# Altium schematic sheet USB.SchDoc: USB to UART
size A; CompanyName: CUInSpace; DrawnBy: Matteo Golin; Engineer: Matteo Golin; Organization: CUInSpace; Revision: B; SheetNumber: 2; SheetTotal: 2
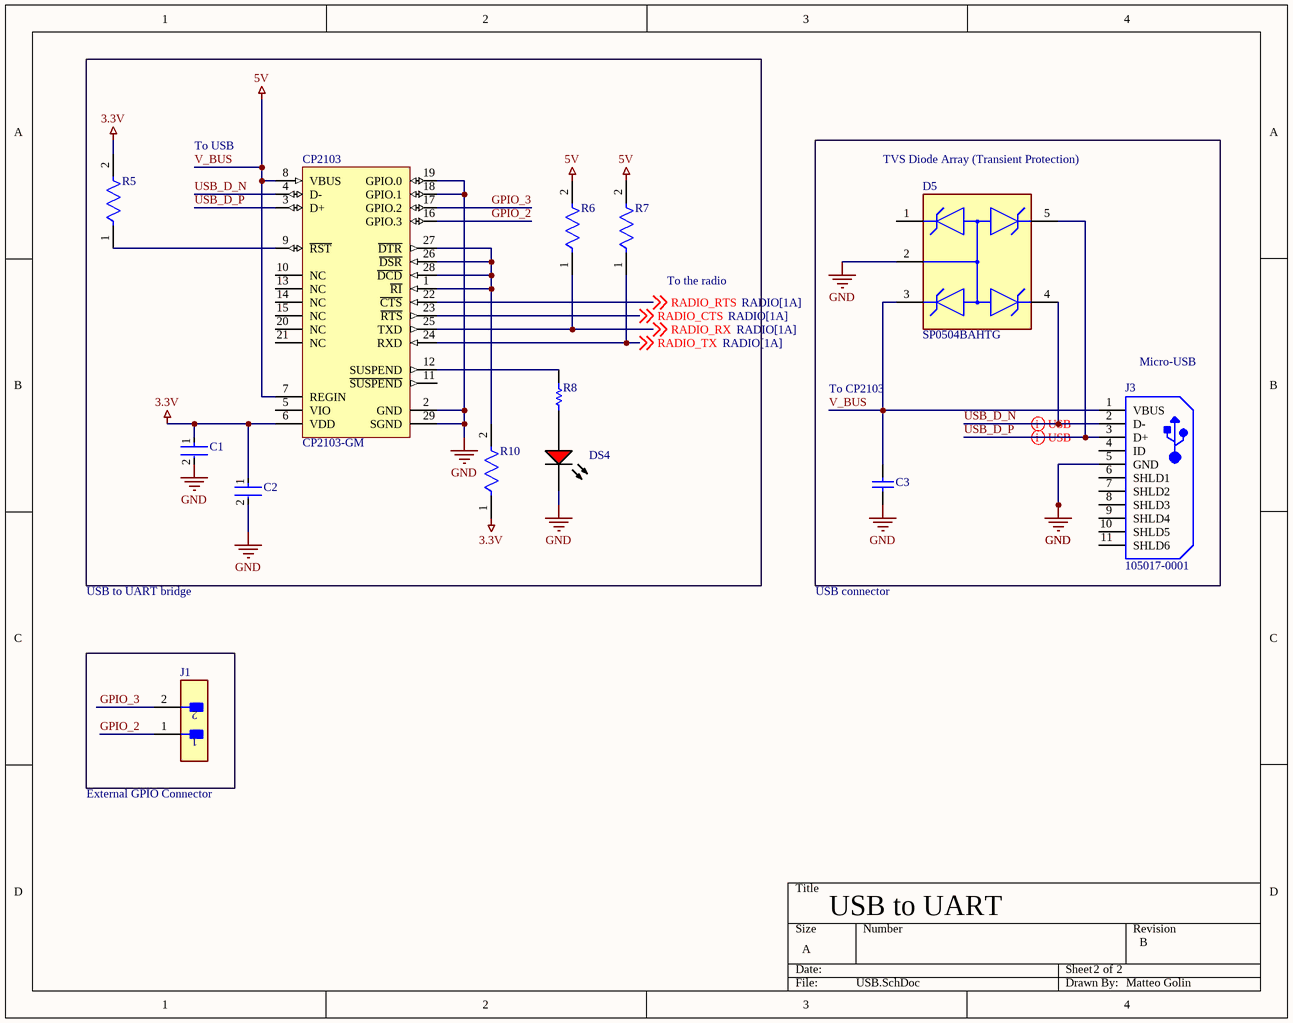
[diagram p0: USB.SchDoc]

## Parts
C1  C0603C104K5RACTU  [FP-C0603C-CF-MFG]  (value not drawn)
C2  C0603C475K9PACTU  [FP-C0603-CG-MFG]  (value not drawn)
C3  C1206C105K5RACTU  [CAPC3216X110X50LL20T25]  (value not drawn)
CP2103  CP2103-GM  [SLAB-QFN-28-3125x3125TP_A_M]
D5  SP0504BAHTG  [FP-SP0504BAHTG-MFG]
DS4  HSMH-C190  [AVAG-HSMX-C190_V]  (value not drawn)
J1  M22-2510205  [FP-M22-2510205-MFG]  (value not drawn)
J3  105017-0001  [USB-MICRO-B_V]
R5  CRCW040210K0FKED  [FP-CRCW0402-e3-IPC_B]  (value not drawn)
R6  CRCW0402100KFKED  [FP-CRCW0402-e3-IPC_C]  (value not drawn)
R7  CRCW0402100KFKED  [FP-CRCW0402-e3-IPC_C]  (value not drawn)
R8  CRCW0402220KFKED  [RESC1005X40X25LL05T05]  (value not drawn)
R10  CRCW040210K0FKED  [FP-CRCW0402-e3-IPC_B]  (value not drawn)

## Nets
3.3V: C1.1 C2.1 CP2103.6(VDD) R5.2 R10.1
GND: C1.2 C2.2 C3.1 CP2103.2(GND) CP2103.18(GPIO.1) CP2103.19(GPIO.0) CP2103.29(SGND) D5.2 DS4.2(K) J3.5(GND)
V_BUS: C3.2 CP2103.7(REGIN) CP2103.8(VBUS) D5.3 J3.1(VBUS) R6.2 R7.2  [also labelled 5V]
GPIO_2: CP2103.16(GPIO.3) J1.1
GPIO_3: CP2103.17(GPIO.2) J1.2
RADIO_CTS: CP2103.23(~{RTS}) ; off-sheet RADIO_CTS
RADIO_RTS: CP2103.22(~{CTS}) ; off-sheet RADIO_RTS
RADIO_RX: CP2103.25(TXD) R6.1 ; off-sheet RADIO_RX
RADIO_TX: CP2103.24(RXD) R7.1 ; off-sheet RADIO_TX
USB_D_N: CP2103.4(D-) D5.4 J3.2(D-)
USB_D_P: CP2103.3(D+) D5.5 J3.3(D+)
NetCP2103_1: CP2103.1(~{RI}) CP2103.26(~{DSR}) CP2103.27(~{DTR}) CP2103.28(~{DCD}) R10.2
NetCP2103_9: CP2103.9(~{RST}) R5.1
NetCP2103_12: CP2103.12(SUSPEND) R8.2
NetDS4_1: DS4.1(A) R8.1

Not connected (* = marked no-connect by the designer): CP2103 5(VIO) 10(NC) 11(~{SUSPEND}) 13(NC) 14(NC) 15(NC) 20(NC) 21(NC); D5 1; J3 4(ID) 6(SHLD1) 7(SHLD2) 8(SHLD3) 9(SHLD4) 10(SHLD5) 11(SHLD6)

## Layout directives
differential pair: USB_D_N, USB_D_P

## Notes on the sheet
- To USB
- TVS Diode Array (Transient Protection)
- (near R7) To the radio
- (near J3) Micro-USB
- To CP2103
- USB to UART bridge
- USB connector
- External GPIO Connector

## Library data of the parts
C1 = CMP-2006-03061-2: CAP CER 0.1UF 50V X7R 0603; Manufacturer: KEMET; Tolerance: 0.1; Temperature Coefficient: 30ppm/°C; Material: Ceramic; Automotive Grade: Grade 1; Value: 0.10 μF; Temperature: -55°C to +125°C; RoHS: TRUE; Temperature Range High: +125°C; Lead Free: Yes; Octopart: https://octopart.com/c0603c104k5ractu-kemet-139244; Digikey Description: CAP CER 0.1UF 50V X7R 0603; Category: Cap; Package: C0603C-CF; ComponentLink2Description: Datasheet; Temperature Range Low: -55°C; Device Class L1: Passive Components; Voltage Rating: 50 V; Automotive: Yes; Device Class L3: Ceramic Capacitors; ComponentLink2URL: https://api.kemet.com/component-edge/download/datasheet/C0603C100J5GACAUTO.pdf; Capacitance: 0.10 μF; Device Class L2: Capacitors; Manufacturer Part Number: C0603C104K5RACTU; Temperature Characteristic: X7R; Height: 0.87mm
C2 = CMP-2006-02256-2: CAP CER 4.7UF 6.3V X5R 0603; Manufacturer: Kemet; Temperature Coefficient: 15%; Tolerance: 10%; Material: Ceramic; Device Class L3: Ceramic Capacitors; RoHS: TRUE; Value: 4.7uF; Lead Free: Yes; ComponentLink2Description: Datasheet; Mouser Description: Multilayer Ceramic Capacitors MLCC - SMD/SMT 6.3volts 4.7uF X5R 10%; Package: C0603-CG; Digikey Description: CAP CER 4.7UF 6.3V X5R 0603; ComponentLink2URL: https://content.kemet.com/datasheets/KEM_C1006_X5R_SMD.pdf; Category: Cap; Temperature Range Low: -55°C; Capacitance: 4.7uF; Temperature: -55°C to +85°C; Octopart: https://octopart.com/c0603c475k9pactu-kemet-104242; Ipc Land Pattern Name: CAPC16080X80; Voltage Rating: 6.3V; Temperature Range High: +85°C; Height: 0.9mm; Temperature Characteristic: X5R; Device Class L1: Passive Components; Manufacturer Part Number: C0603C475K9PACTU; Automotive: No; Device Class L2: Capacitors
C3 = CMP-2000-06011-1: Chip Capacitor, 1 uF, +/- 10%, 50 V, -55 to 125 degC, 1206 (3216 Metric), RoHS, Tape and Reel; Manufacturer: Kemet; Case Height: 1mm; Dielectric: X7R; Voltage Rating: 50V; Capacitance: 1uF; Temperature Coefficient / Code: +/-15%; Case Length: 3.2mm; Case Width: 1.6mm; Type: SMDMLCCX7R6.3-250VDCCommericalGrade; Class: Class1; Capacitance - nF: 1000nF; Datasheet URL: http://www.kemet.com/docfinder?Partnumber=C1206C105K5RACTU; Product Category: MultilayerCeramicCapacitorsMLCC-SMD/SMT; Termination Style: SMD/SMT; Dimensions: 1.6mmWx3.2mmLx1mmH; Voltage Rating DC: 50V; Datasheet Version: 02/2016; Packaging: Reel; Brand: Kemet; RoHS: Details; Minimum Operating Temperature: -55C; Operating Temperature Range: -55Cto+125C; Package Reference: 1206; Manufacturer URL: http://www.kemet.com/; Product: GeneralTypeMLCCs; Tolerance: 10%; Package Description: 2-Pin Surface Mount Device, Body 3.2 x 1.6 mm; Mounting Technology: SurfaceMount; Case Code - mm: 3216; Maximum Operating Temperature: +125C; Series: C1206C; Factory Pack Quantity: 2500; Package / Case: 1206(3216metric); Case Code - in: 1206
CP2103 = CMP-0511-00006-1: Single-Chip USB to UART Bridge, 1024 Bytes EEPROM, -40 to 85 degC, 28-pin QFN, Tube; Manufacturer: Silicon Labs; Internal Oscillator: TRUE; Sub-Family: USB Bridges; PackageDescription: 28-Pin Quad-Flat No-Leads Package, Body 5 x 5 mm, Pitch 0.5 mm; PartNumber: CP2103-GM; ComponentLink2Description: Datasheet; ComponentLink2URL: http://www.silabs.com/Support%20Documents/TechnicalDocs/CP2103.pdf; ComponentLink1URL: http://www.silabs.com/; Mounting Technology: Surface Mount; ComponentLink1Description: Manufacturer URL; PackageReference: QFN-28; EEPROM: 1024 Bytes; DatasheetVersion: Rev. 1.0; ComponentLink3Description: Package Specification; ComponentLink3URL: http://www.silabs.com/Support%20Documents/TechnicalDocs/C8051F35x.pdf
D5 = CMP-08607-000010-1: TVS DIODE 5.5V 8.5V SOT23-5; Manufacturer: Littelfuse; Direction: Unidirectional; Number Of Channels: 4; Value: 30pF; Standoff Height: 0mm; Mouser Description: TVS Diodes / ESD Suppressors SP0504BAHTG; Device Class L2: TVS Diodes; Manufacturer Part Number: SP0504BAHTG; Category: Diode; Device Class L3: unset; Automotive: No; Lead Free: Yes; Digikey Description: TVS DIODE 5.5V 8.5V SOT23-5; ComponentLink2URL: https://www.littelfuse.com/~/media/electronics/datasheets/tvs_diode_arrays/littelfuse_tvs_diode_array_sp05_datasheet.pdf.pdf; Octopart: https://octopart.com/sp0504bahtg-littelfuse-587259; Temperature Range Low: -40°C; Temperature: -40°C to +125°C; Clamping Voltage: 8.5V; Temperature Range High: +125°C; ComponentLink2Description: Datasheet; Height: 1.45mm; Reverse Standoff Voltage: 5.5V; Device Class L1: Circuit Protection; Package: SP0504BAHTG; Capacitance: 30pF; RoHS: TRUE
DS4 = CMP-1744-00004-1: LED Uni-Color Red, 65 mW, 20 mA, -40 to 85 degC, 2-Pin SMD, RoHS, Tape and Reel; Connector Type: USB; Gender: Male; Current Rating: 1 A; Length: 7.5 mm; Lead Pitch: 0.65 mm; PackageReference: HSMX-C190; Package Quantity: 2000; Max Operating Temperature: 85 degC; PackageDescription: 2-Pin Surface Mount Device, Body 1.6 x 0.8 mm, Height 0.9 mm; ComponentLink3Description: Package Specification; Mount: Surface Mount; Min Operating Temperature: -30 degC; ComponentLink3URL: http://www.fairchildsemi.com/dwg/MA/MA03D.pdf; ComponentLink1Description: Manufacturer URL; Contact Material: Copper; Pins: 5; Width: 5.6 mm; ComponentLink2Description: Datasheet; RoHSCompliant: true; DatasheetVersion: Mar-12; Height: 2.8 mm; Packaging: Tape and Reel; Contact Plating: Gold; ComponentLink1URL: http://www.avagotech.com/; REACH SVHC: No SVHC; ComponentLink2URL: http://docs.avagotech.com/docs/AV02-0551EN
J1 = CMP-15831-000005-1: CONN HEADER VERT 2POS 2MM; Manufacturer: Harwin; Conn Gender: Male; Current Rating: 2A; Number Of Contacts: 2; Conn Orientation: Vertical; Temperature Range Low: -40°C; Device Class L1: Connectors; ComponentLink2URL: https://cdn.harwin.com/pdfs/C018XX_M22_Series_Connectors.pdf; Temperature Range High: +105°C; Pitch: 2mm; Number Of Rows: 1; Temperature: -40°C to +105°C; Automotive: No; Device Class L3: unset; Octopart: https://octopart.com/m22-2510205-harwin-2538221; Mouser Description: Headers & Wire Housings 2 PIN SIL VERTICAL GOLD PIN HEADER; Height: 5.45mm; Category: Conn; Digikey Description: CONN HEADER VERT 2POS 2MM; Contact Material: Gold,Nickel; Lead Free: Yes; ComponentLink2Description: Datasheet; Manufacturer Part Number: M22-2510205; Device Class L2: Headers and Wire Housings; Package: 0; Footprint Url: https://cdn.harwin.com/pdfs/M22-251.pdf; RoHS: TRUE
J3 = CMP-2000-05827-1: Micro-USB B Receptacle, Right Angle, Bottom Mount, Surface Mount, with Solder Tabs, -30 to 85 degC, 5-Pin USB, RoHS, Tape and Reel; Manufacturer: Molex; Featured Product: Micro-USBConnectorsUSBConnectors; Other Names: WM1399DKR; Package Version: Rev. F, 12/2012; Number of Contacts: 5; Connector Type: USB-microB; Catalog Drawings: 1050170001; 3D Model: 105017-0001.stp; Mating Products: WM17145-ND-CABLEMICROUSBBTOSTDA1.0MWM17147-ND-CABLEMICROUSBBTOSTDA2.0MWM17146-ND-CABLEMICROUSBBTOSTDA1.5M; PCN Assembly/Origin: ResinSupplier21/Oct/2015; Voltage - Max: 30V; Online Catalog: Molex-MicroUSB; Manufacturer URL: http://www.molex.com/; Package Description: 5-Leads USB, Micro B, Body 7.5 x 5 mm, Pitch 0.65 mm; Datasheet URL: http://www.molex.com/elqNow/elqRedir.htm?ref=http://www.molex.com/webdocs/datasheets/pdf/en-us/1050170001_IO_CONNECTORS.pdf; Ingress Protection: -; Datasheet Version: 03/2016; Mounting Type: BoardCutout,SurfaceMount,RightAngle; Circuits: 5; Standard Package: 1; Package Reference: MICRO-B; Package URL: http://www.molex.com/pdm_docs/sd/1050170001_sd.pdf; Category: Connectors,Interconnects; Series: -; RoHS Information: 1050170001CertofCompliance; Features: Shielded,SolderRetention; Family: USB,DVI,HDMIConnectors; Specifications: -; Gender: Receptacle; Packaging: Digi-Reel®; Mounting Technology: SurfaceMount
R5 R10 = CMP-2002-08135-2: RES SMD 10K OHM 1% 1/16W 0402; Power Rating: 63mW; Resistance: 10kR; Voltage Rating: 50V; Temperature Coefficient: 100ppm/°C; Case Code (Metric): 1005; Features: Automotive AEC-Q200; Termination: SMD/SMT; Mount: Surface Mount; Package Quantity: 10; Packaging: Tape and Reel; Case Code (Imperial): 0402; Weight: 2.3E-05oz; Lead Free: Lead Free; Width: 0.02inch; Max Power Dissipation: 63mW; Tolerance: 1%; Number of Terminations: 2; Height: 0.35mm; Number of Pins: 2; Composition: Thick Film; Length: 1mm; Voltage Rating (DC): 50V; Case/Package: 0402; Radiation Hardening: No; Contact Plating: Tin; Depth: 0.5mm; Military Standard: Not; Min Operating Temperature: -55°C; Max Operating Temperature: 155°C
R6 R7 = CMP-2002-08123-3: RES Thick Film, 100kΩ, 1%, 0.063W, 100ppm/°C, 0402; Power Rating: 63mW; Resistance: 100kR; Voltage Rating (DC): 50V; Lead Free: Lead Free; Height: 0.35mm; Contact Plating: Tin; Min Operating Temperature: -55°C; Package Quantity: 10000; Case/Package: 0402; Temperature Coefficient: 100ppm/°C; Number of Terminations: 2; Packaging: Tape and Reel; Max Power Dissipation: 63mW; Case Code (Metric): 1005; Mount: Surface Mount; Width: 0.02inch; Termination: SMD/SMT; Length: 1mm; Number of Pins: 2; Weight: 2.3E-05oz; Radiation Hardening: No; Tolerance: 1%; Military Standard: Not; Features: Automotive AEC-Q200; Depth: 0.5mm; Composition: Thick Film; Max Operating Temperature: 155°C; Voltage Rating: 50V; Case Code (Imperial): 0402
R8 = CMP-2002-08370-1: Manufacturer: Vishay Dale; Part Number: CRCW0402220KFKED